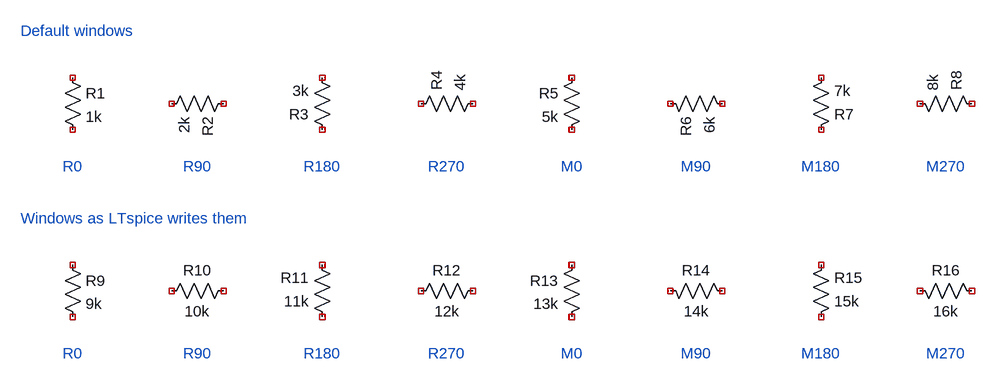
[diagram p0: schematic res_orientations.asc]
res_orientations.asc, the LTspice schematic file:
Version 4
SHEET 1 1600 560
SYMBOL res 80 88 R0
SYMATTR InstName R1
SYMATTR Value 1k
SYMBOL res 344 128 R90
SYMATTR InstName R2
SYMATTR Value 2k
SYMBOL res 496 200 R180
SYMATTR InstName R3
SYMATTR Value 3k
SYMBOL res 616 160 R270
SYMATTR InstName R4
SYMATTR Value 4k
SYMBOL res 880 88 M0
SYMATTR InstName R5
SYMATTR Value 5k
SYMBOL res 1000 128 M90
SYMATTR InstName R6
SYMATTR Value 6k
SYMBOL res 1232 200 M180
SYMATTR InstName R7
SYMATTR Value 7k
SYMBOL res 1496 160 M270
SYMATTR InstName R8
SYMATTR Value 8k
SYMBOL res 80 376 R0
SYMATTR InstName R9
SYMATTR Value 9k
SYMBOL res 344 416 R90
WINDOW 0 0 56 VBottom 2
WINDOW 3 32 56 VTop 2
SYMATTR InstName R10
SYMATTR Value 10k
SYMBOL res 496 488 R180
WINDOW 0 36 76 Left 2
WINDOW 3 36 40 Left 2
SYMATTR InstName R11
SYMATTR Value 11k
SYMBOL res 616 448 R270
WINDOW 0 32 56 VTop 2
WINDOW 3 0 56 VBottom 2
SYMATTR InstName R12
SYMATTR Value 12k
SYMBOL res 880 376 M0
SYMATTR InstName R13
SYMATTR Value 13k
SYMBOL res 1000 416 M90
WINDOW 0 0 56 VBottom 2
WINDOW 3 32 56 VTop 2
SYMATTR InstName R14
SYMATTR Value 14k
SYMBOL res 1232 488 M180
WINDOW 0 36 76 Left 2
WINDOW 3 36 40 Left 2
SYMATTR InstName R15
SYMATTR Value 15k
SYMBOL res 1496 448 M270
WINDOW 0 32 56 VTop 2
WINDOW 3 0 56 VBottom 2
SYMATTR InstName R16
SYMATTR Value 16k
TEXT 96 240 Center 2 ;R0
TEXT 288 240 Center 2 ;R90
TEXT 480 240 Center 2 ;R180
TEXT 672 240 Center 2 ;R270
TEXT 864 240 Center 2 ;M0
TEXT 1056 240 Center 2 ;M90
TEXT 1248 240 Center 2 ;M180
TEXT 1440 240 Center 2 ;M270
TEXT 96 528 Center 2 ;R0
TEXT 288 528 Center 2 ;R90
TEXT 480 528 Center 2 ;R180
TEXT 672 528 Center 2 ;R270
TEXT 864 528 Center 2 ;M0
TEXT 1056 528 Center 2 ;M90
TEXT 1248 528 Center 2 ;M180
TEXT 1440 528 Center 2 ;M270
TEXT 16 32 Left 2 ;Default windows
TEXT 16 320 Left 2 ;Windows as LTspice writes them

The netlist it stands for:
* res_orientations.asc
R1 NC_01 NC_02 1k
R2 NC_03 NC_04 2k
R3 NC_05 NC_06 3k
R4 NC_07 NC_08 4k
R5 NC_09 NC_10 5k
R6 NC_11 NC_12 6k
R7 NC_13 NC_14 7k
R8 NC_15 NC_16 8k
R9 NC_17 NC_18 9k
R10 NC_19 NC_20 10k
R11 NC_21 NC_22 11k
R12 NC_23 NC_24 12k
R13 NC_25 NC_26 13k
R14 NC_27 NC_28 14k
R15 NC_29 NC_30 15k
R16 NC_31 NC_32 16k
* R0
* R90
* R180
* R270
* M0
* M90
* M180
* M270
* R0
* R90
* R180
* R270
* M0
* M90
* M180
* M270
* Default windows
* Windows as LTspice writes them
.backanno
.end